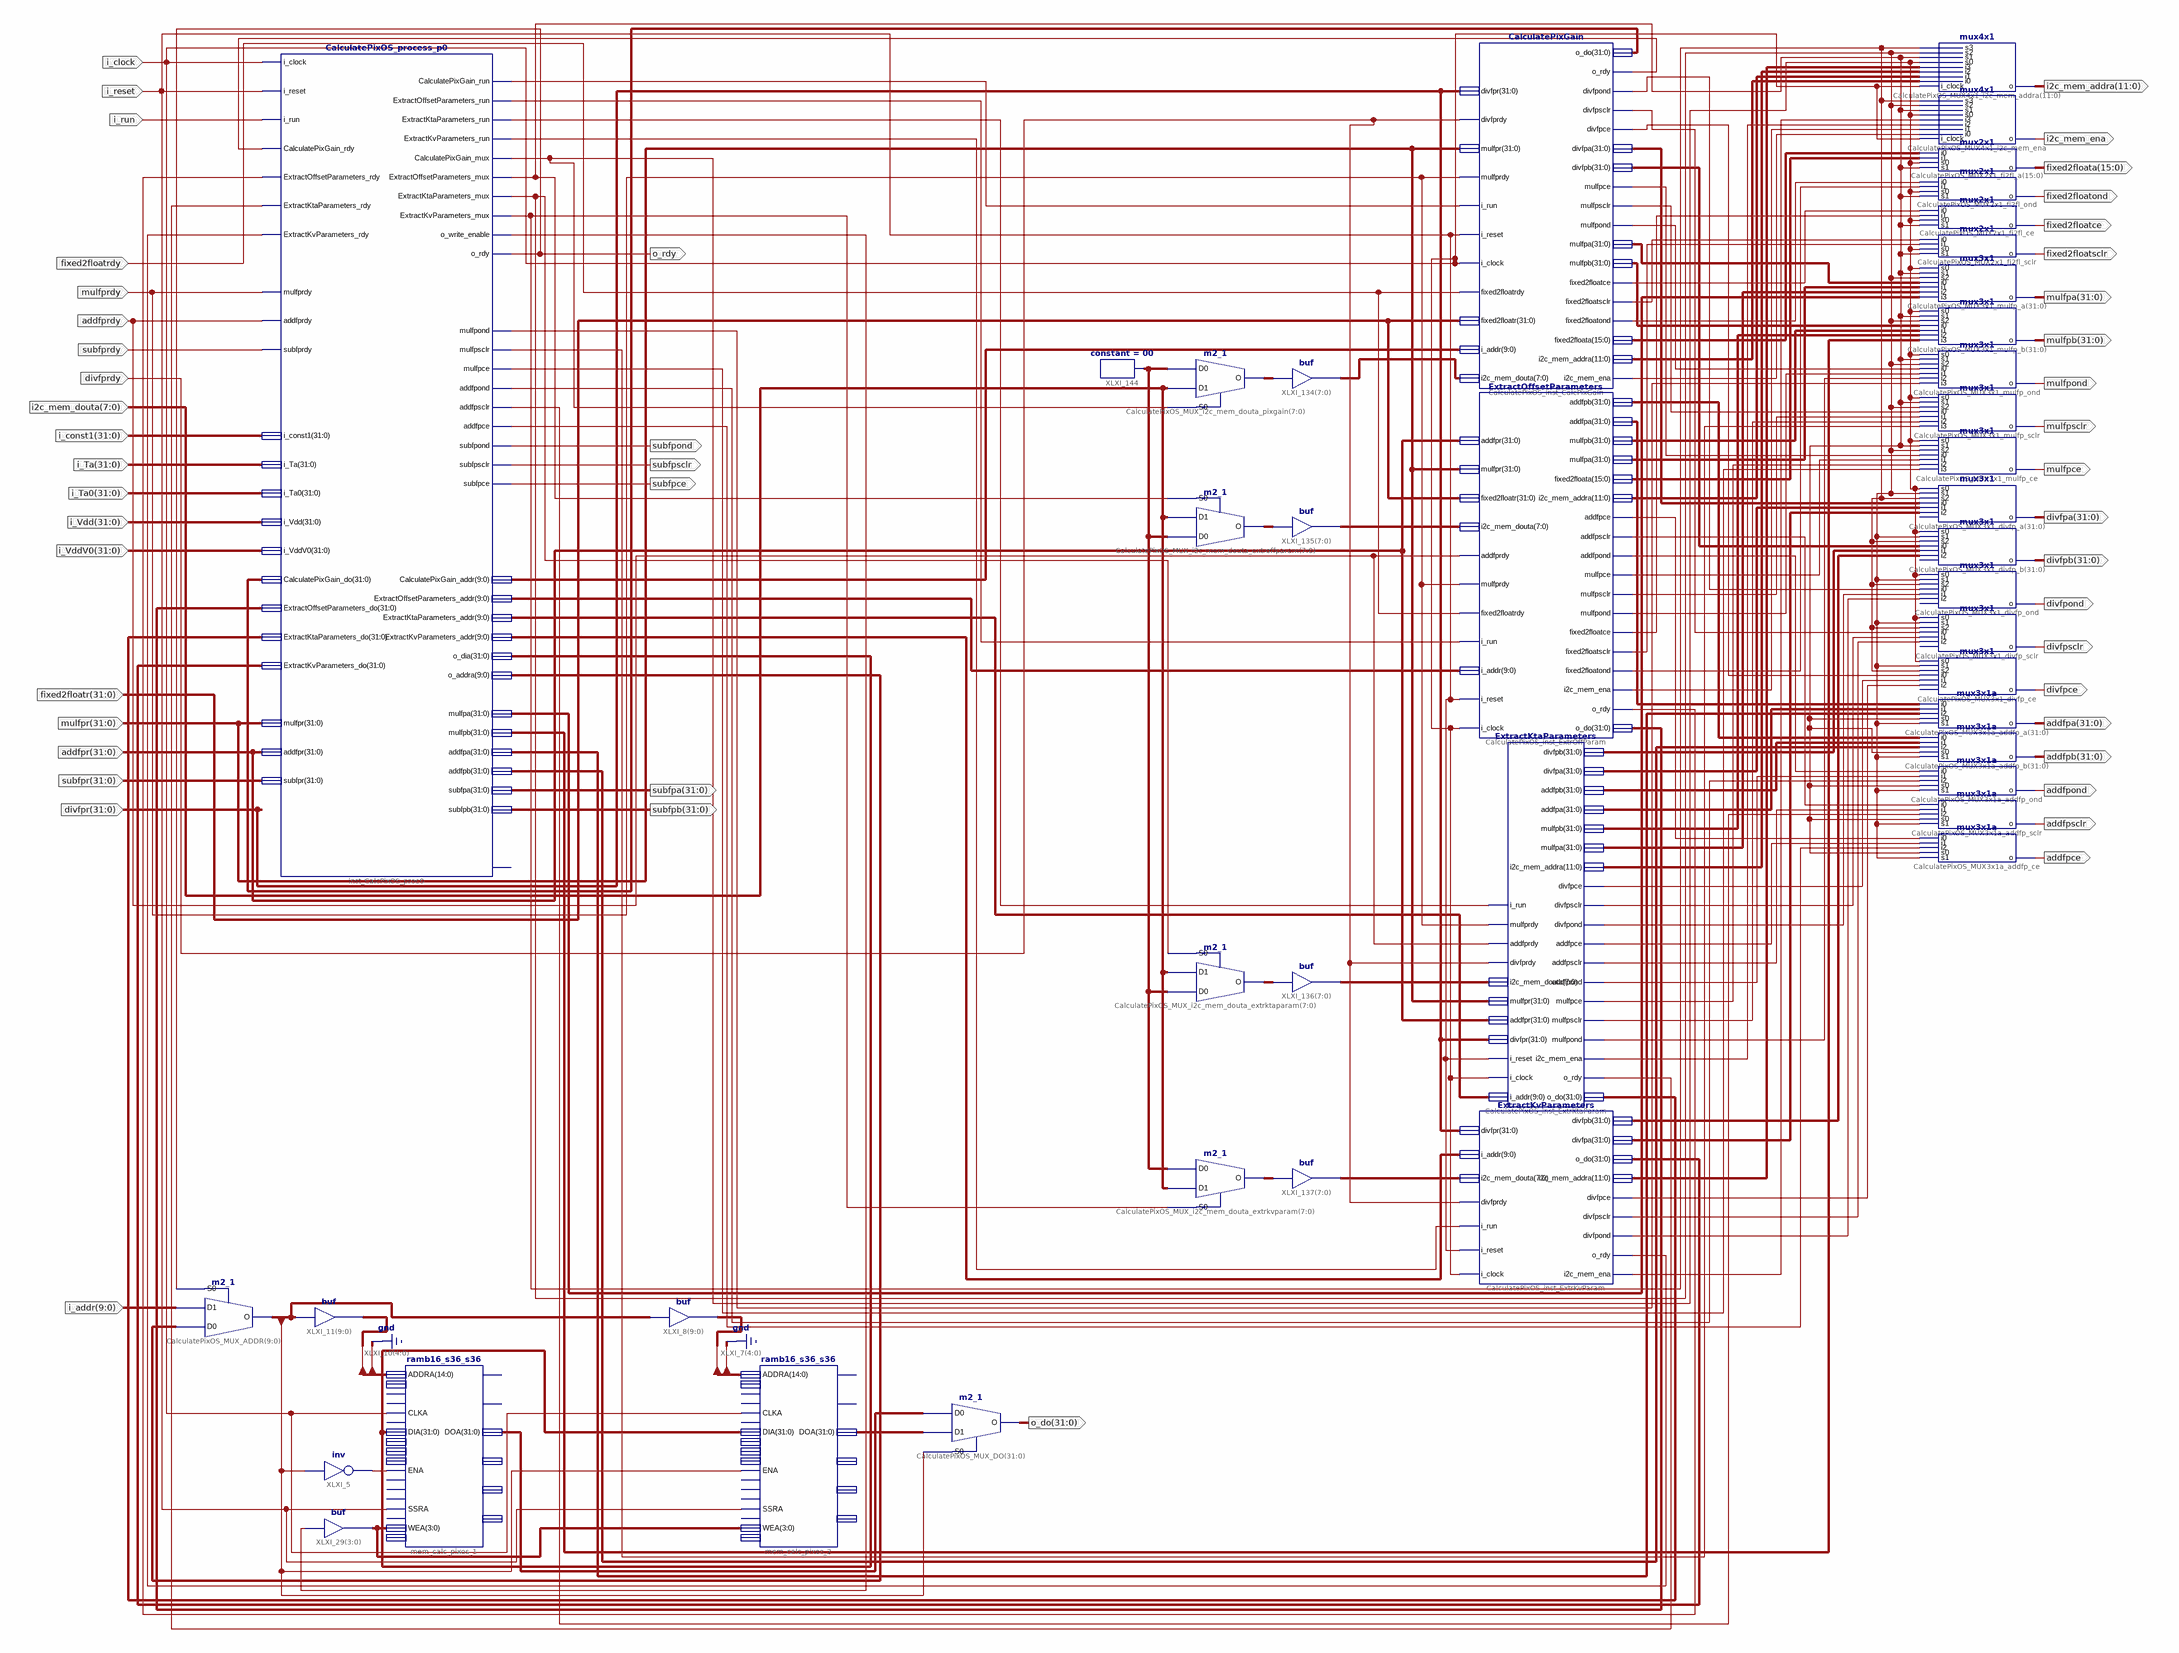
[diagram p0: schematic sheet 1]
// Xilinx ISE schematic CalculatePixOS.sch (virtex4) as structural Verilog: 43 symbols, 48 ports
module CalculatePixOS (
  input  [9:0] i_addr,
  input  i_clock,
  input  i_reset,
  input  i_run,
  input  [31:0] i_const1,
  input  [31:0] i_Ta,
  input  [31:0] i_Ta0,
  input  [31:0] i_Vdd,
  input  [31:0] i_VddV0,
  input  mulfprdy,
  input  [31:0] mulfpr,
  input  [31:0] addfpr,
  input  [31:0] fixed2floatr,
  input  [31:0] subfpr,
  input  [31:0] divfpr,
  input  fixed2floatrdy,
  input  addfprdy,
  input  subfprdy,
  input  divfprdy,
  input  [7:0] i2c_mem_douta,
  output [31:0] o_do,
  output [11:0] i2c_mem_addra,
  output i2c_mem_ena,
  output o_rdy,
  output [15:0] fixed2floata,
  output fixed2floatond,
  output fixed2floatce,
  output fixed2floatsclr,
  output [31:0] mulfpa,
  output [31:0] mulfpb,
  output mulfpond,
  output mulfpsclr,
  output mulfpce,
  output [31:0] divfpa,
  output [31:0] divfpb,
  output divfpond,
  output divfpsclr,
  output divfpce,
  output [31:0] addfpa,
  output [31:0] addfpb,
  output addfpond,
  output addfpsclr,
  output addfpce,
  output subfpond,
  output subfpsclr,
  output subfpce,
  output [31:0] subfpa,
  output [31:0] subfpb
);

  wire calculatepixgainmux, extractktaparametersmux, extractkvparametersmux, extractoffsetparametersmux,
       XLXN_59, XLXN_216, XLXN_385, XLXN_386, XLXN_387, XLXN_388, XLXN_401, XLXN_402, XLXN_403, XLXN_404,
       XLXN_407, XLXN_408, XLXN_409, XLXN_410, XLXN_464, XLXN_465, XLXN_469, XLXN_470, XLXN_473, XLXN_474,
       XLXN_495, XLXN_496, XLXN_497, XLXN_498, XLXN_503, XLXN_504, XLXN_505, XLXN_506, XLXN_511, XLXN_512,
       XLXN_513, XLXN_514, XLXN_534, XLXN_535, XLXN_536, XLXN_537, XLXN_538, XLXN_539, XLXN_540, XLXN_542,
       XLXN_543, XLXN_564, XLXN_565, XLXN_566, XLXN_567, XLXN_568, XLXN_569, XLXN_570, XLXN_571, XLXN_572;
  wire [3:0] XLXN_139;
  wire [7:0] XLXN_573, XLXN_574, XLXN_575, XLXN_576, XLXN_580, XLXN_581, XLXN_582, XLXN_583, XLXN_589;
  wire [9:0] mux_addr1, XLXN_210, XLXN_412, XLXN_413, XLXN_414, XLXN_415;
  wire [11:0] cpgi2caddr, eopi2caddr, ktai2caddr, kvi2caddr;
  wire [14:5] XLXN_44, XLXN_45;
  wire [15:0] XLXN_459, XLXN_461;
  wire [31:0] XLXN_78, XLXN_79, XLXN_211, XLXN_416, XLXN_417, XLXN_418, XLXN_419, XLXN_477, XLXN_478,
       XLXN_479, XLXN_480, XLXN_487, XLXN_488, XLXN_489, XLXN_490, XLXN_518, XLXN_519, XLXN_520, XLXN_526,
       XLXN_529, XLXN_530, XLXN_558, XLXN_559, XLXN_560, XLXN_561, XLXN_562, XLXN_563;

  CalculatePixOS_process_p0 inst_CalcPixOS_proc0 (
    .i_clock(i_clock), .i_reset(i_reset), .i_run(i_run), .CalculatePixGain_rdy(XLXN_407),
    .ExtractOffsetParameters_rdy(XLXN_408), .ExtractKtaParameters_rdy(XLXN_409),
    .ExtractKvParameters_rdy(XLXN_410), .mulfprdy(mulfprdy), .addfprdy(addfprdy), .subfprdy(subfprdy),
    .i_const1(i_const1), .i_Ta(i_Ta), .i_Ta0(i_Ta0), .i_Vdd(i_Vdd), .i_VddV0(i_VddV0),
    .CalculatePixGain_do(XLXN_416), .ExtractOffsetParameters_do(XLXN_417),
    .ExtractKtaParameters_do(XLXN_418), .ExtractKvParameters_do(XLXN_419), .mulfpr(mulfpr), .addfpr(addfpr),
    .subfpr(subfpr), .CalculatePixGain_run(XLXN_401), .ExtractOffsetParameters_run(XLXN_402),
    .ExtractKtaParameters_run(XLXN_403), .ExtractKvParameters_run(XLXN_404),
    .CalculatePixGain_mux(calculatepixgainmux), .ExtractOffsetParameters_mux(extractoffsetparametersmux),
    .ExtractKtaParameters_mux(extractktaparametersmux), .ExtractKvParameters_mux(extractkvparametersmux),
    .o_write_enable(XLXN_216), .o_rdy(o_rdy), .mulfpond(XLXN_498), .mulfpsclr(XLXN_506), .mulfpce(XLXN_514),
    .addfpond(XLXN_566), .addfpsclr(XLXN_569), .addfpce(XLXN_572), .subfpond(subfpond),
    .subfpsclr(subfpsclr), .subfpce(subfpce), .CalculatePixGain_addr(XLXN_412),
    .ExtractOffsetParameters_addr(XLXN_413), .ExtractKtaParameters_addr(XLXN_414),
    .ExtractKvParameters_addr(XLXN_415), .o_dia(XLXN_211), .o_addra(XLXN_210), .mulfpa(XLXN_480),
    .mulfpb(XLXN_490), .addfpa(XLXN_560), .addfpb(XLXN_563), .subfpa(subfpa), .subfpb(subfpb));  // open: o_dummy
  assign XLXN_45 = mux_addr1;  // buf XLXI_8[9..0], 10 bits wide
  assign XLXN_44 = mux_addr1;  // buf XLXI_11[9..0], 10 bits wide
  not XLXI_5 (XLXN_59, mux_addr1[9]);
  ramb16_s36_s36 #(.WRITE_WIDTH_B(36), .WRITE_WIDTH_A(36), .WRITE_MODE_B("READ_FIRST"), .WRITE_MODE_A("READ_FIRST"), .READ_WIDTH_B(36), .READ_WIDTH_A(36)) mem_calc_pixos_1 (
    .ADDRA({XLXN_44, {5{1'b0}}}), .CLKA(i_clock), .DIA(XLXN_211), .ENA(XLXN_59), .SSRA(i_reset),
    .WEA(XLXN_139), .DOA(XLXN_79));  // open: ADDRB, CASCADEINA, CASCADEINB, CLKB, DIB, DIPA, DIPB, REGCEA, REGCEB, ENB, SSRB, WEB, CASCADEOUTA, CASCADEOUTB, DOB, DOPA, DOPB
  m2_1 CalculatePixOS_MUX_DO[31:0] (.D0(XLXN_79), .D1(XLXN_78), .S0(mux_addr1[9]), .O(o_do));
  assign XLXN_139 = {4{XLXN_216}};  // buf XLXI_29[3..0], 4 bits wide
  m2_1 CalculatePixOS_MUX_ADDR[9:0] (.D0(XLXN_210), .D1(i_addr), .S0(o_rdy), .O(mux_addr1));
  ramb16_s36_s36 #(.WRITE_WIDTH_B(36), .WRITE_WIDTH_A(36), .WRITE_MODE_B("READ_FIRST"), .WRITE_MODE_A("READ_FIRST"), .READ_WIDTH_B(36), .READ_WIDTH_A(36)) mem_calc_pixos_2 (
    .ADDRA({XLXN_45, {5{1'b0}}}), .CLKA(i_clock), .DIA(XLXN_211), .ENA(mux_addr1[9]), .SSRA(i_reset),
    .WEA(XLXN_139), .DOA(XLXN_78));  // open: ADDRB, CASCADEINA, CASCADEINB, CLKB, DIB, DIPA, DIPB, REGCEA, REGCEB, ENB, SSRB, WEB, CASCADEOUTA, CASCADEOUTB, DOB, DOPA, DOPB
  CalculatePixGain CalculatePixOS_inst_CalcPixGain (
    .i2c_mem_douta(XLXN_573), .i_addr(XLXN_412), .fixed2floatr(fixed2floatr),
    .fixed2floatrdy(fixed2floatrdy), .i_clock(i_clock), .i_reset(i_reset), .i_run(XLXN_401),
    .mulfprdy(mulfprdy), .mulfpr(mulfpr), .divfprdy(divfprdy), .divfpr(divfpr), .i2c_mem_ena(XLXN_385),
    .i2c_mem_addra(cpgi2caddr), .fixed2floata(XLXN_459), .fixed2floatond(XLXN_464),
    .fixed2floatsclr(XLXN_473), .fixed2floatce(XLXN_469), .mulfpb(XLXN_487), .mulfpa(XLXN_477),
    .mulfpond(XLXN_495), .mulfpsclr(XLXN_503), .mulfpce(XLXN_511), .divfpb(XLXN_526), .divfpa(XLXN_518),
    .divfpce(XLXN_540), .divfpsclr(XLXN_537), .divfpond(XLXN_534), .o_rdy(XLXN_407), .o_do(XLXN_416));
  ExtractOffsetParameters CalculatePixOS_inst_ExtrOffParam (
    .i_clock(i_clock), .i_reset(i_reset), .i_addr(XLXN_413), .i_run(XLXN_402),
    .fixed2floatrdy(fixed2floatrdy), .mulfprdy(mulfprdy), .addfprdy(addfprdy), .i2c_mem_douta(XLXN_574),
    .fixed2floatr(fixed2floatr), .mulfpr(mulfpr), .addfpr(addfpr), .o_rdy(XLXN_408), .i2c_mem_ena(XLXN_386),
    .fixed2floatond(XLXN_465), .fixed2floatsclr(XLXN_474), .fixed2floatce(XLXN_470), .mulfpond(XLXN_496),
    .mulfpsclr(XLXN_504), .mulfpce(XLXN_512), .addfpond(XLXN_564), .addfpsclr(XLXN_567), .addfpce(XLXN_570),
    .i2c_mem_addra(eopi2caddr), .fixed2floata(XLXN_461), .mulfpa(XLXN_478), .mulfpb(XLXN_488),
    .addfpa(XLXN_558), .addfpb(XLXN_561), .o_do(XLXN_417));
  ExtractKtaParameters CalculatePixOS_inst_ExtrKtaParam (
    .i_addr(XLXN_414), .i_clock(i_clock), .i_reset(i_reset), .divfpr(divfpr), .addfpr(addfpr),
    .mulfpr(mulfpr), .i2c_mem_douta(XLXN_575), .divfprdy(divfprdy), .addfprdy(addfprdy), .mulfprdy(mulfprdy),
    .i_run(XLXN_403), .o_rdy(XLXN_409), .i2c_mem_ena(XLXN_387), .mulfpond(XLXN_497), .mulfpsclr(XLXN_505),
    .mulfpce(XLXN_513), .addfpond(XLXN_565), .addfpsclr(XLXN_568), .addfpce(XLXN_571), .divfpond(XLXN_535),
    .divfpsclr(XLXN_538), .divfpce(XLXN_542), .i2c_mem_addra(ktai2caddr), .mulfpa(XLXN_479),
    .mulfpb(XLXN_489), .addfpa(XLXN_559), .addfpb(XLXN_562), .divfpa(XLXN_519), .divfpb(XLXN_529),
    .o_do(XLXN_418));
  ExtractKvParameters CalculatePixOS_inst_ExtrKvParam (
    .i_addr(XLXN_415), .i_reset(i_reset), .i_clock(i_clock), .i_run(XLXN_404), .divfprdy(divfprdy),
    .i2c_mem_douta(XLXN_576), .divfpr(divfpr), .o_do(XLXN_419), .o_rdy(XLXN_410), .i2c_mem_ena(XLXN_388),
    .divfpond(XLXN_536), .divfpsclr(XLXN_539), .divfpce(XLXN_543), .i2c_mem_addra(kvi2caddr),
    .divfpa(XLXN_520), .divfpb(XLXN_530));
  mux4x1 CalculatePixOS_MUX4x1_i2c_mem_addra[11:0] (
    .i_clock(i_clock), .o(i2c_mem_addra), .i0(cpgi2caddr), .i1(eopi2caddr), .i2(ktai2caddr), .i3(kvi2caddr),
    .s0(calculatepixgainmux), .s1(extractoffsetparametersmux), .s2(extractktaparametersmux),
    .s3(extractkvparametersmux));
  mux4x1 CalculatePixOS_MUX4x1_i2c_mem_ena (
    .i_clock(i_clock), .o(i2c_mem_ena), .i0(XLXN_385), .i1(XLXN_386), .i2(XLXN_387), .i3(XLXN_388),
    .s0(calculatepixgainmux), .s1(extractoffsetparametersmux), .s2(extractktaparametersmux),
    .s3(extractkvparametersmux));
  mux2x1 CalculatePixOS_MUX2x1_fi2fl_a[15:0] (
    .s1(extractoffsetparametersmux), .s0(calculatepixgainmux), .i1(XLXN_461), .i0(XLXN_459), .o(fixed2floata));
  mux2x1 CalculatePixOS_MUX2x1_fi2fl_ond (
    .s1(extractoffsetparametersmux), .s0(calculatepixgainmux), .i1(XLXN_465), .i0(XLXN_464),
    .o(fixed2floatond));
  mux2x1 CalculatePixOS_MUX2x1_fi2fl_ce (
    .s1(extractoffsetparametersmux), .s0(calculatepixgainmux), .i1(XLXN_470), .i0(XLXN_469), .o(fixed2floatce));
  mux2x1 CalculatePixOS_MUX2x1_fi2fl_sclr (
    .s1(extractoffsetparametersmux), .s0(calculatepixgainmux), .i1(XLXN_474), .i0(XLXN_473),
    .o(fixed2floatsclr));
  mux3x1 CalculatePixOS_MUX3x1_mulfp_a[31:0] (
    .i3(XLXN_480), .i2(XLXN_479), .i1(XLXN_478), .i0(XLXN_477), .s2(extractktaparametersmux),
    .s1(extractoffsetparametersmux), .s0(calculatepixgainmux), .o(mulfpa));
  mux3x1 CalculatePixOS_MUX3x1_mulfp_b[31:0] (
    .i3(XLXN_490), .i2(XLXN_489), .i1(XLXN_488), .i0(XLXN_487), .s2(extractktaparametersmux),
    .s1(extractoffsetparametersmux), .s0(calculatepixgainmux), .o(mulfpb));
  mux3x1 CalculatePixOS_MUX3x1_mulfp_ond (
    .i3(XLXN_498), .i2(XLXN_497), .i1(XLXN_496), .i0(XLXN_495), .s2(extractktaparametersmux),
    .s1(extractoffsetparametersmux), .s0(calculatepixgainmux), .o(mulfpond));
  mux3x1 CalculatePixOS_MUX3x1_mulfp_sclr (
    .i3(XLXN_506), .i2(XLXN_505), .i1(XLXN_504), .i0(XLXN_503), .s2(extractktaparametersmux),
    .s1(extractoffsetparametersmux), .s0(calculatepixgainmux), .o(mulfpsclr));
  mux3x1 CalculatePixOS_MUX3x1_mulfp_ce (
    .i3(XLXN_514), .i2(XLXN_513), .i1(XLXN_512), .i0(XLXN_511), .s2(extractktaparametersmux),
    .s1(extractoffsetparametersmux), .s0(calculatepixgainmux), .o(mulfpce));
  mux3x1 CalculatePixOS_MUX3x1_divfp_a[31:0] (
    .i2(XLXN_520), .i1(XLXN_519), .i0(XLXN_518), .s2(extractkvparametersmux), .s1(extractktaparametersmux),
    .s0(calculatepixgainmux), .o(divfpa));  // open: i3
  mux3x1 CalculatePixOS_MUX3x1_divfp_b[31:0] (
    .i2(XLXN_530), .i1(XLXN_529), .i0(XLXN_526), .s2(extractkvparametersmux), .s1(extractktaparametersmux),
    .s0(calculatepixgainmux), .o(divfpb));  // open: i3
  mux3x1 CalculatePixOS_MUX3x1_divfp_ond (
    .i2(XLXN_536), .i1(XLXN_535), .i0(XLXN_534), .s2(extractkvparametersmux), .s1(extractktaparametersmux),
    .s0(calculatepixgainmux), .o(divfpond));  // open: i3
  mux3x1 CalculatePixOS_MUX3x1_divfp_sclr (
    .i2(XLXN_539), .i1(XLXN_538), .i0(XLXN_537), .s2(extractkvparametersmux), .s1(extractktaparametersmux),
    .s0(calculatepixgainmux), .o(divfpsclr));  // open: i3
  mux3x1 CalculatePixOS_MUX3x1_divfp_ce (
    .i2(XLXN_543), .i1(XLXN_542), .i0(XLXN_540), .s2(extractkvparametersmux), .s1(extractktaparametersmux),
    .s0(calculatepixgainmux), .o(divfpce));  // open: i3
  mux3x1a CalculatePixOS_MUX3x1a_addfp_a[31:0] (
    .s1(extractktaparametersmux), .s0(extractoffsetparametersmux), .i2(XLXN_560), .i1(XLXN_559),
    .i0(XLXN_558), .o(addfpa));
  mux3x1a CalculatePixOS_MUX3x1a_addfp_b[31:0] (
    .s1(extractktaparametersmux), .s0(extractoffsetparametersmux), .i2(XLXN_563), .i1(XLXN_562),
    .i0(XLXN_561), .o(addfpb));
  mux3x1a CalculatePixOS_MUX3x1a_addfp_ond (
    .s1(extractktaparametersmux), .s0(extractoffsetparametersmux), .i2(XLXN_566), .i1(XLXN_565),
    .i0(XLXN_564), .o(addfpond));
  mux3x1a CalculatePixOS_MUX3x1a_addfp_sclr (
    .s1(extractktaparametersmux), .s0(extractoffsetparametersmux), .i2(XLXN_569), .i1(XLXN_568),
    .i0(XLXN_567), .o(addfpsclr));
  mux3x1a CalculatePixOS_MUX3x1a_addfp_ce (
    .s1(extractktaparametersmux), .s0(extractoffsetparametersmux), .i2(XLXN_572), .i1(XLXN_571),
    .i0(XLXN_570), .o(addfpce));
  assign XLXN_573 = XLXN_580;  // buf XLXI_134[7..0], 8 bits wide
  assign XLXN_574 = XLXN_581;  // buf XLXI_135[7..0], 8 bits wide
  assign XLXN_575 = XLXN_582;  // buf XLXI_136[7..0], 8 bits wide
  assign XLXN_576 = XLXN_583;  // buf XLXI_137[7..0], 8 bits wide
  m2_1 CalculatePixOS_MUX_i2c_mem_douta_pixgain[7:0] (
    .D0(XLXN_589), .D1(i2c_mem_douta), .S0(calculatepixgainmux), .O(XLXN_580));
  m2_1 CalculatePixOS_MUX_i2c_mem_douta_extroffparam[7:0] (
    .D0(XLXN_589), .D1(i2c_mem_douta), .S0(extractoffsetparametersmux), .O(XLXN_581));
  m2_1 CalculatePixOS_MUX_i2c_mem_douta_extrktaparam[7:0] (
    .D0(XLXN_589), .D1(i2c_mem_douta), .S0(extractktaparametersmux), .O(XLXN_582));
  m2_1 CalculatePixOS_MUX_i2c_mem_douta_extrkvparam[7:0] (
    .D0(XLXN_589), .D1(i2c_mem_douta), .S0(extractkvparametersmux), .O(XLXN_583));
  constant #(.CValue("00")) XLXI_144 (.O(XLXN_589));
endmodule
